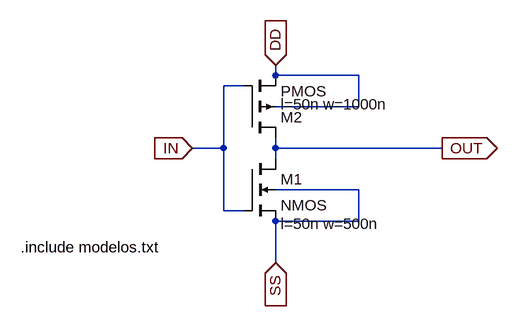
[diagram p0: schematic simb_inv.asc]
simb_inv.asc, the LTspice schematic file:
Version 4
SHEET 1 880 680
WIRE 176 32 176 16
WIRE 304 32 176 32
WIRE 128 48 96 48
WIRE 304 80 304 32
WIRE 304 80 176 80
WIRE 96 144 96 48
WIRE 96 144 48 144
WIRE 176 144 176 128
WIRE 432 144 176 144
WIRE 176 160 176 144
WIRE 304 208 176 208
WIRE 96 240 96 144
WIRE 128 240 96 240
WIRE 304 256 304 208
WIRE 304 256 176 256
WIRE 176 320 176 256
FLAG 176 16 DD
IOPIN 176 16 In
FLAG 48 144 IN
IOPIN 48 144 In
FLAG 176 320 SS
IOPIN 176 320 In
FLAG 432 144 OUT
IOPIN 432 144 Out
SYMBOL nmos4 128 160 R0
WINDOW 123 56 100 Left 2
SYMATTR Value2 l=50n w=500n
SYMATTR InstName M1
SYMBOL pmos4 128 128 M180
WINDOW 123 56 52 Left 2
SYMATTR Value2 l=50n w=1000n
SYMATTR InstName M2
TEXT -216 296 Left 2 !.include modelos.txt

The netlist it stands for:
* simb_inv.asc
M1 OUT IN SS SS NMOS l=50n w=500n
M2 OUT IN DD DD PMOS l=50n w=1000n
.model NMOS NMOS
.model PMOS PMOS
.lib standard.mos
.include modelos.txt
.backanno
.end